# EAGLE design pots (EAGLE 9.6.2)
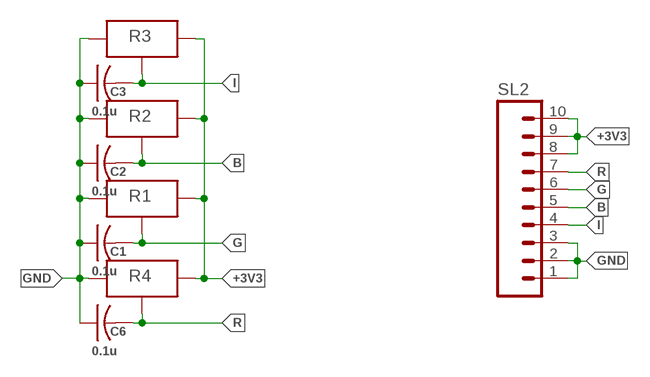
[diagram p0: schematic, sheet 1]

## Parts
C1  0.1u  CAP0603  [C0603]
C2  0.1u  CAP0603  [C0603]
C3  0.1u  CAP0603  [C0603]
C6  0.1u  CAP0603  [C0603]
R1  POTNORMAL  [RJ9W]
R2  POTNORMAL  [RJ9W]
R3  POTNORMAL  [RJ9W]
R4  POTNORMAL  [RJ9W]
SL2  M10  [10P]

## Nets
+3V3: R1.A R2.A R3.A R4.A SL2.8 SL2.9 SL2.10
B: C2.2 R2.S SL2.5
G: C1.2 R1.S SL2.6
GND: C1.1 C2.1 C3.1 C6.1 R1.E R2.E R3.E R4.E SL2.1 SL2.2 SL2.3
I: C3.2 R3.S SL2.4
R: C6.2 R4.S SL2.7

## Library data of the parts
C1-C3 C6 = CEDT_JANUARY_2015_v5:CAP
R1-R4 = CEDTv78:POT
SL2 = con-amp-quick:M10: AMP QUICK CONNECTOR; OC_FARNELL: unknown; OC_NEWARK: unknown

## Net classes
0 default: width 0.406 mm

## Board
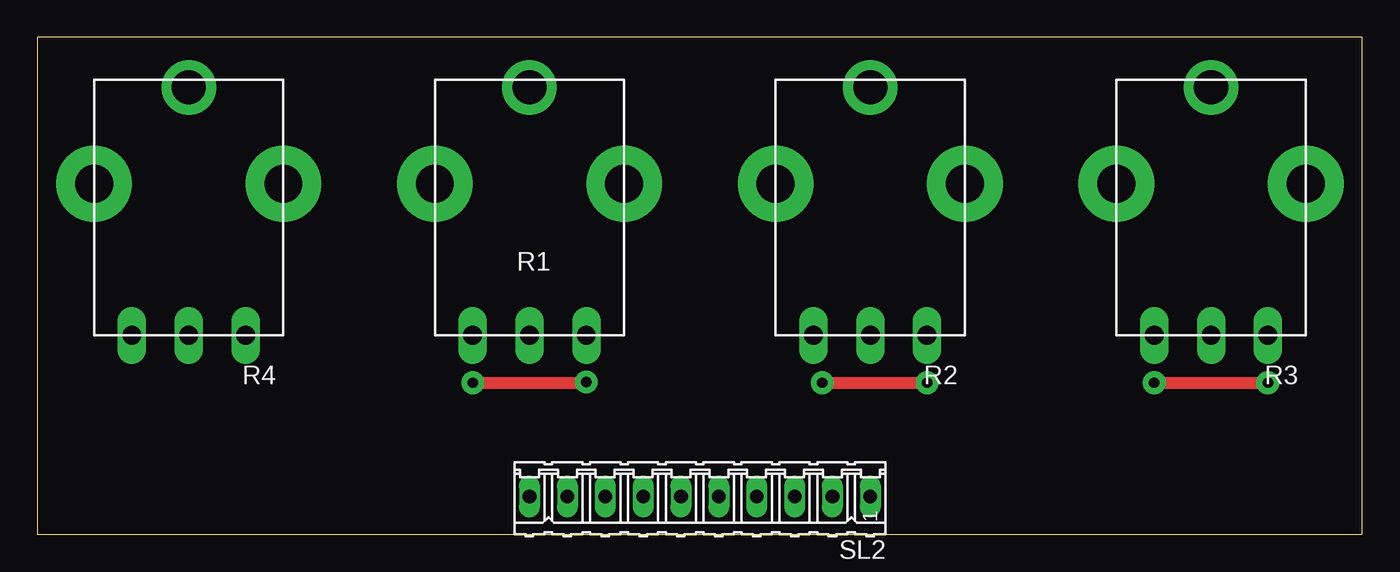
[diagram p1: board, top side]
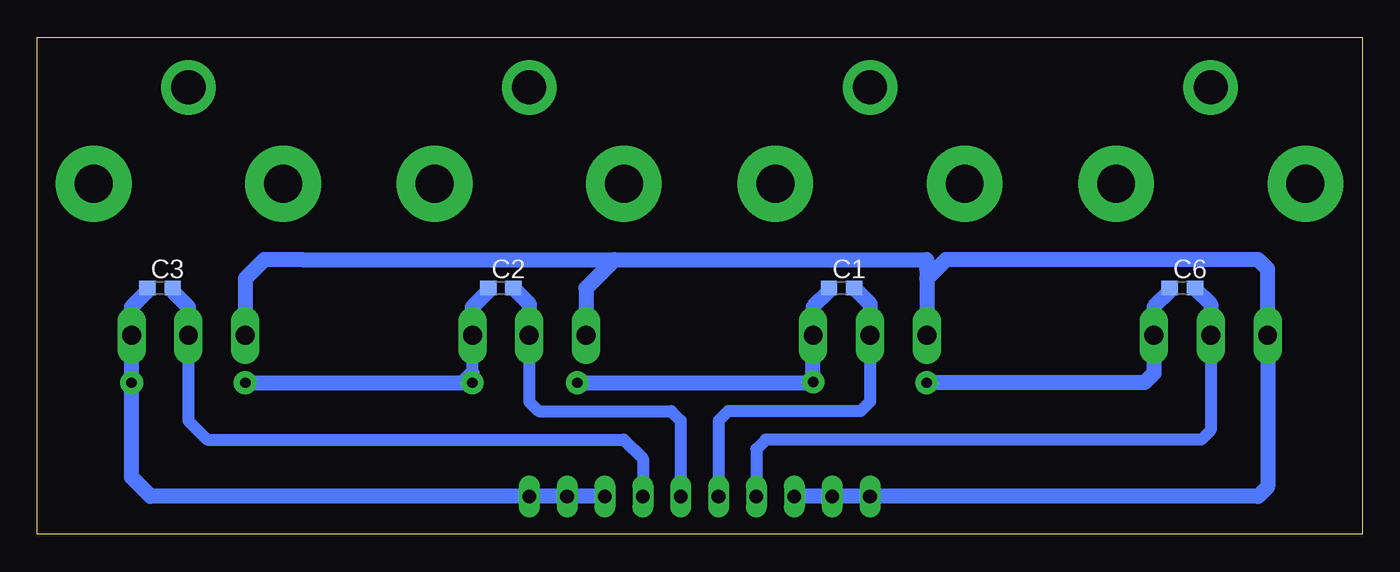
[diagram p2: board, bottom side, seen from below]

Size 88.88 x 33.33 mm. Coordinates in mm from the lower left corner, seen from the top.
Outline: 0,0 88.88,0 88.88,33.33 0,33.33 0,0
Copper layers (1*16): Top 0.035mm / dielectric 1.5mm / Bottom 0.035mm
Design rules "default": minimum track width 6mil, minimum drill 0.35mm, track to track 6mil, track to pad 6mil, pad to pad 6mil, via to via 6mil, smd to smd 6mil, copper to edge 40mil, drill to drill 6mil, minimum pad ring 10mil, minimum via ring 8mil, stop-mask expansion 4mil, vias tented up to drill 0mil, thermal gap 10mil

### Footprints (pad centres in the part's own frame; a part is rotated, then mirrored left to right if it is on the bottom)
C0603 = smd 1.1 x 1: 1 -0.85,0; 2 0.85,0
RJ9W = drill 1.27 long: A 3.81,8.255; E -3.81,8.255; S 0,8.255 | drill 2.286 pad 3.658: P$1 0,-8.382 | drill 2.54 pad 5.08: P$3 6.35,-1.905; P$4 -6.35,-1.905
10P = drill 0.914 long: 1 -11.43,0; 2 -8.89,0; 3 -6.35,0; 4 -3.81,0; 5 -1.27,0; 6 1.27,0; 7 3.81,0; 8 6.35,0; 9 8.89,0; 10 11.43,0

### Placement (x,y rotation side)
C1  34.92,16.51 0 bottom
C2  57.78,16.51 0 bottom
C3  80.64,16.51 0 bottom
C6  12.06,16.51 0 bottom
R1  33.02,21.59 180 top
R2  55.88,21.59 180 top
R3  78.74,21.59 180 top
R4  10.16,21.59 180 top
SL2  44.45,2.54 180 top

### Tracks (layer width: path | path; a pad name or v marks a point on that pad's centre or on a via)
+3V3
  Bottom 0.813: 29.21,17.14 R1.A | 29.21,18.41 50.16,18.41 71.12,18.41 | 6.35,12.7 R4.A | SL2.10 SL2.9 36.2,2.54 SL2.8
  Bottom 1.016: 36.2,2.54 SL2.10 6.99,2.54 6.35,3.17 R4.A 6.35,17.78 6.99,18.41 27.94,18.41 28.57,17.78 | SL2.9 SL2.8 | 28.57,17.78 29.21,17.78 | R3.A 74.93,17.14 73.66,18.41 71.12,18.41 29.21,18.41 29.21,17.78 | 29.21,17.14 28.57,17.78 | 29.21,17.78 R1.A | 50.16,18.41 52.07,16.51 R2.A
B
  Bottom 0.813: R2.S 55.88,8.89 55.24,8.26 46.35,8.26 45.72,7.62 SL2.5
  Bottom 1.016: C2.2 55.88,15.46 R2.S
G
  Bottom 0.813: R1.S 33.02,8.89 33.66,8.26 42.55,8.26 43.18,7.62 SL2.6
  Bottom 1.016: C1.2 33.02,15.46 R1.S
GND  (via drill 0.7 pad 1.52)
  Top 0.813: v29.21,10.16 36.78,10.16 v36.83,10.21 | v74.93,10.16 v82.55,10.16 | v52.65,10.16 v59.69,10.16
  Bottom 0.813: 36.88,10.16 v36.83,10.21 | 59.69,10.79 R2.E
  Bottom 1.016: SL2.3 SL2.2 SL2.1 81.28,2.54 82.55,3.81 v82.55,10.16 R3.E 82.55,15.24 81.5,16.3 C3.1 | v74.93,10.16 60.33,10.16 59.69,10.79 v59.69,10.16 | v52.65,10.16 36.88,10.16 | v36.83,10.21 R1.E 36.83,15.24 35.77,16.3 C1.1 | v29.21,10.16 14.61,10.16 13.97,10.79 R4.E 13.97,15.24 12.91,16.3 C6.1 | C2.1 58.63,16.3 59.69,15.24 R2.E
I
  Bottom 0.813: R3.S 78.74,7.62 77.47,6.35 49.53,6.35 48.26,5.08 SL2.4
  Bottom 1.016: C3.2 79.8,16.3 78.74,15.24 R3.S
R
  Bottom 0.813: R4.S 10.16,6.99 10.79,6.35 40.01,6.35 40.64,5.71 SL2.7
  Bottom 1.016: C6.2 10.16,15.46 R4.S